# Altium schematic sheet Driver.SchDoc
size 1600 x 1200 mm; SheetNumber: 1; SheetTotal: 1; SPICEModelCacheBTRAQOWF: <root> / <DocumentId>BTRAQOWF</DocumentId> / </root>
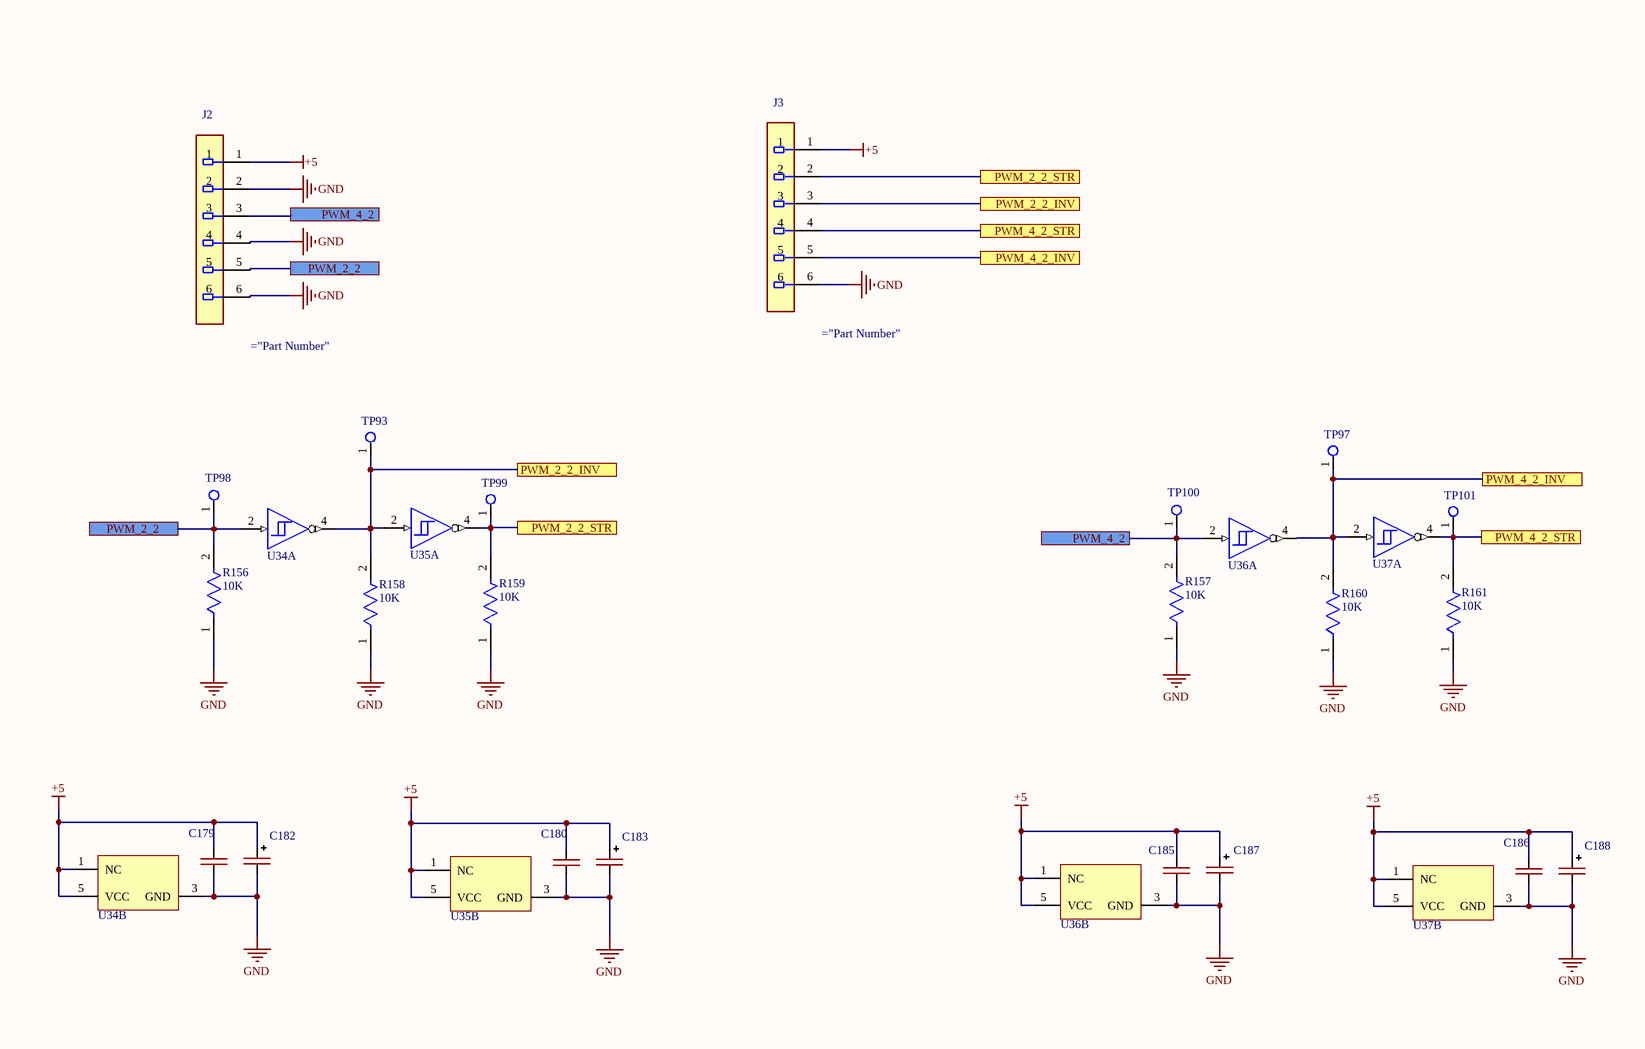
[diagram p0: Driver.SchDoc, left]
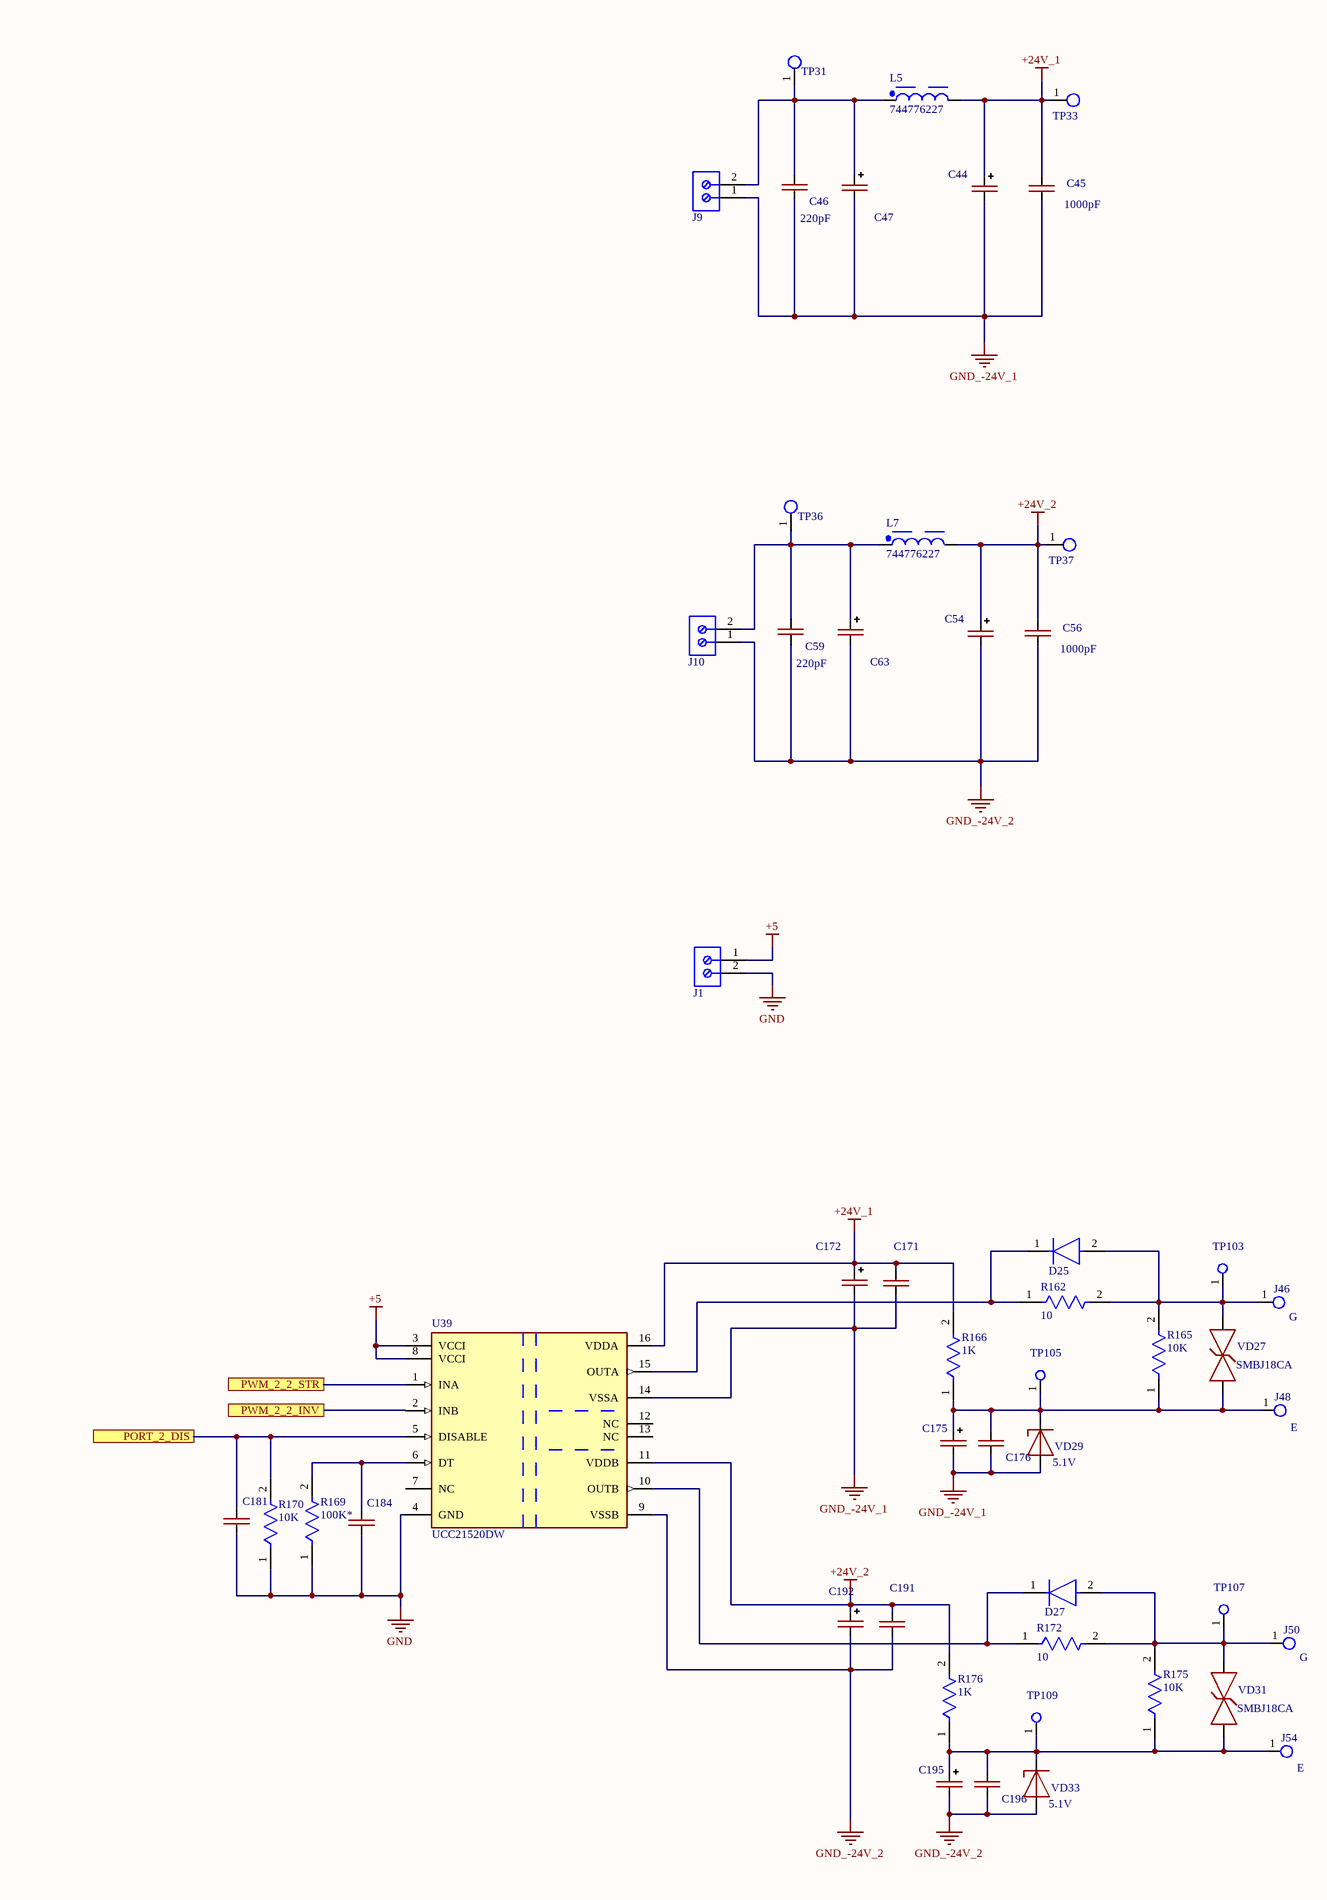
[diagram p1: Driver.SchDoc, middle]
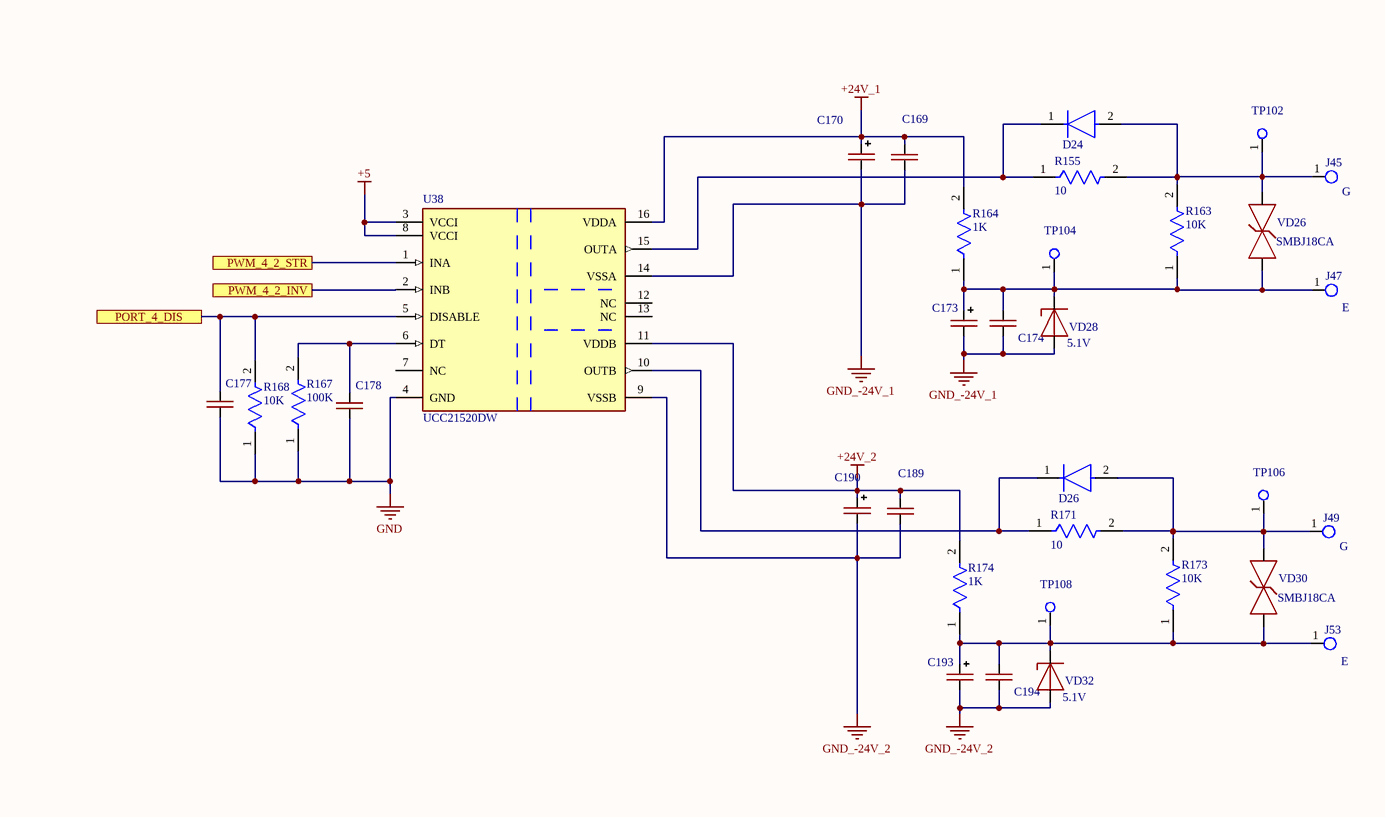
[diagram p2: Driver.SchDoc, right]

## Parts
C44  (no value)  [CAPPOL-12x25]
C45  1000pF  [CAP-1206]
C46  220pF  [CAP-0805]
C47  (no value)  [CAPPOL-12x25]
C54  (no value)  [CAPPOL-12x25]
C56  1000pF  [CAP-1206]
C59  220pF  [CAP-0805]
C63  (no value)  [CAPPOL-12x25]
C169  CAP-NON-POLAR  [CAP-0805]  (value not drawn)
C170  CAP-POLAR  [CAPPOL-16x25]  (value not drawn)
C171  CAP-NON-POLAR  [CAP-0805]  (value not drawn)
C172  CAP-POLAR  [CAPPOL-16x25]  (value not drawn)
C173  CAP-POLAR  [CAP-TAN-D]  (value not drawn)
C174  CAP-NON-POLAR  [CAP-0805]  (value not drawn)
C175  CAP-POLAR  [CAP-TAN-D]  (value not drawn)
C176  CAP-NON-POLAR  [CAP-0805]  (value not drawn)
C177  CAP-NON-POLAR  [CAP-0805]  (value not drawn)
C178  CAP-NON-POLAR  [CAP-0805]  (value not drawn)
C179  CAP-NON-POLAR  [CAP-0805]  (value not drawn)
C180  CAP-NON-POLAR  [CAP-0805]  (value not drawn)
C181  CAP-NON-POLAR  [CAP-0805]  (value not drawn)
C182  CAP-POLAR  [CAP-TAN-D]  (value not drawn)
C183  CAP-POLAR  [CAP-TAN-D]  (value not drawn)
C184  CAP-NON-POLAR  [CAP-0805]  (value not drawn)
C185  CAP-NON-POLAR  [CAP-0805]  (value not drawn)
C186  CAP-NON-POLAR  [CAP-0805]  (value not drawn)
C187  CAP-POLAR  [CAP-TAN-D]  (value not drawn)
C188  CAP-POLAR  [CAP-TAN-D]  (value not drawn)
C189  CAP-NON-POLAR  [CAP-0805]  (value not drawn)
C190  CAP-POLAR  [CAPPOL-16x25]  (value not drawn)
C191  CAP-NON-POLAR  [CAP-0805]  (value not drawn)
C192  CAP-POLAR  [CAPPOL-16x25]  (value not drawn)
C193  CAP-POLAR  [CAP-TAN-D]  (value not drawn)
C194  CAP-NON-POLAR  [CAP-0805]  (value not drawn)
C195  CAP-POLAR  [CAP-TAN-D]  (value not drawn)
C196  CAP-NON-POLAR  [CAP-0805]  (value not drawn)
D24  US1G  [US1G_SMA]  (value not drawn)
D25  US1G  [US1G_SMA]  (value not drawn)
D26  US1G  [US1G_SMA]  (value not drawn)
D27  US1G  [US1G_SMA]  (value not drawn)
J1  691101710002  [691101710002]  (value not drawn)
J2  (no value)  [Sullins_SWR25X-NRTC-S06-ST-BA_MFG]
J3  (no value)  [Sullins_SWR25X-NRTC-S06-ST-BA_MFG]
J9  691101710002  [691101710002]  (value not drawn)
J10  691101710002  [691101710002]  (value not drawn)
J45  G  [Klema_PCB_15A]
J46  G  [Klema_PCB_15A]
J47  E  [Klema_PCB_15A]
J48  E  [Klema_PCB_15A]
J49  G  [Klema_PCB_15A]
J50  G  [Klema_PCB_15A]
J53  E  [Klema_PCB_15A]
J54  E  [Klema_PCB_15A]
L5  744776227  [WE-PD2_1054]
L7  744776227  [WE-PD2_1054]
R155  10  [RES-2512]
R156  10K  [RES-0805]
R157  10K  [RES-0805]
R158  10K  [RES-0805]
R159  10K  [RES-0805]
R160  10K  [RES-0805]
R161  10K  [RES-0805]
R162  10  [RES-2512]
R163  10K  [RES-0805]
R164  1K  [RES-2512]
R165  10K  [RES-0805]
R166  1K  [RES-2512]
R167  100K  [RES-0805]
R168  10K  [RES-0805]
R169  100K*  [RES-0805]
R170  10K  [RES-0805]
R171  10  [RES-2512]
R172  10  [RES-2512]
R173  10K  [RES-0805]
R174  1K  [RES-2512]
R175  10K  [RES-0805]
R176  1K  [RES-2512]
TP31  Test_Point_PCB  [Test_Point]  (value not drawn)
TP33  Test_Point_PCB  [Test_Point]  (value not drawn)
TP36  Test_Point_PCB  [Test_Point]  (value not drawn)
TP37  Test_Point_PCB  [Test_Point]  (value not drawn)
TP93  Test_Point_PCB  [Test_Point]  (value not drawn)
TP97  Test_Point_PCB  [Test_Point]  (value not drawn)
TP98  Test_Point_PCB  [Test_Point]  (value not drawn)
TP99  Test_Point_PCB  [Test_Point]  (value not drawn)
TP100  Test_Point_PCB  [Test_Point]  (value not drawn)
TP101  Test_Point_PCB  [Test_Point]  (value not drawn)
TP102  Test_Point_PCB  [Test_Point]  (value not drawn)
TP103  Test_Point_PCB  [Test_Point]  (value not drawn)
TP104  Test_Point_PCB  [Test_Point]  (value not drawn)
TP105  Test_Point_PCB  [Test_Point]  (value not drawn)
TP106  Test_Point_PCB  [Test_Point]  (value not drawn)
TP107  Test_Point_PCB  [Test_Point]  (value not drawn)
TP108  Test_Point_PCB  [Test_Point]  (value not drawn)
TP109  Test_Point_PCB  [Test_Point]  (value not drawn)
U34  74LVC1G14  [SOT23-5_N]  (value not drawn)  (parts A,B of 2)
U35  74LVC1G14  [SOT23-5_N]  (value not drawn)  (parts A,B of 2)
U36  74LVC1G14  [SOT23-5_N]  (value not drawn)  (parts A,B of 2)
U37  74LVC1G14  [SOT23-5_N]  (value not drawn)  (parts A,B of 2)
U38  UCC21520DW  [FP-DW0016B-MFG]
U39  UCC21520DW  [FP-DW0016B-MFG]
VD26  SMBJ18CA  [DO-214AA]
VD27  SMBJ18CA  [DO-214AA]
VD28  5.1V  [DO-35]
VD29  5.1V  [DO-35]
VD30  SMBJ18CA  [DO-214AA]
VD31  SMBJ18CA  [DO-214AA]
VD32  5.1V  [DO-35]
VD33  5.1V  [DO-35]

## Ports
PORT_2_DIS, PORT_4_DIS, PWM_2_2, PWM_2_2_INV, PWM_2_2_STR, PWM_4_2, PWM_4_2_INV, PWM_4_2_STR

## Nets
+5: C179.2 C180.2 C182.1(+) C183.1(+) C185.2 C186.2 C187.1(+) C188.1(+) J1.1 J2.1 J3.1 U34.1(NC) U34.5(VCC) U35.1(NC) U35.5(VCC) U36.1(NC) U36.5(VCC) U37.1(NC) U37.5(VCC) U38.3(VCCI) U38.8(VCCI) U39.3(VCCI) U39.8(VCCI)
+24V_1: C44.1(+) C45.2 C169.2 C170.1(+) C171.2 C172.1(+) L5.2 R164.2 R166.2 TP33.1(G9) U38.16(VDDA) U39.16(VDDA)
+24V_2: C54.1(+) C56.2 C189.2 C190.1(+) C191.2 C192.1(+) L7.2 R174.2 R176.2 TP37.1(G9) U38.11(VDDB) U39.11(VDDB)
GND: C177.1 C178.1 C179.1 C180.1 C181.1 C182.2(-) C183.2(-) C184.1 C185.1 C186.1 C187.2(-) C188.2(-) J1.2 J2.2 J2.4 J2.6 J3.6 R156.1 R157.1 R158.1 R159.1 R160.1 R161.1 R167.1 R168.1 R169.1 R170.1 U34.3(GND) U35.3(GND) U36.3(GND) U37.3(GND) U38.4(GND) U39.4(GND)
GND_-24V_1: C44.2(-) C45.1 C46.1 C47.2(-) C169.1 C170.2(-) C171.1 C172.2(-) C173.2(-) C174.1 C175.2(-) C176.1 J9.1 U38.14(VSSA) U39.14(VSSA) VD28.2(A) VD29.2(A)
GND_-24V_2: C54.2(-) C56.1 C59.1 C63.2(-) C189.1 C190.2(-) C191.1 C192.2(-) C193.2(-) C194.1 C195.2(-) C196.1 J10.1 U38.9(VSSB) U39.9(VSSB) VD32.2(A) VD33.2(A)
PORT_2_DIS: C181.2 R170.2 U39.5(DISABLE) ; port PORT_2_DIS
PORT_4_DIS: C177.2 R168.2 U38.5(DISABLE) ; port PORT_4_DIS
PWM_2_2: J2.5 R156.2 TP98.1(G9) U34.2(A) ; port PWM_2_2
PWM_2_2_INV: J3.3 R158.2 TP93.1(G9) U34.4(Y) U35.2(A) U39.2(INB) ; port PWM_2_2_INV
PWM_2_2_STR: J3.2 R159.2 TP99.1(G9) U35.4(Y) U39.1(INA) ; port PWM_2_2_STR
PWM_4_2: J2.3 R157.2 TP100.1(G9) U36.2(A) ; port PWM_4_2
PWM_4_2_INV: J3.5 R160.2 TP97.1(G9) U36.4(Y) U37.2(A) U38.2(INB) ; port PWM_4_2_INV
PWM_4_2_STR: J3.4 R161.2 TP101.1(G9) U37.4(Y) U38.1(INA) ; port PWM_4_2_STR
NetC46_2: C46.2 C47.1(+) J9.2 L5.1 TP31.1(G9)
NetC59_2: C59.2 C63.1(+) J10.2 L7.1 TP36.1(G9)
NetC173_1: C173.1(+) C174.2 J47.1 R163.1 R164.1 TP104.1(G9) VD26.1(C) VD28.1(C)
NetC175_1: C175.1(+) C176.2 J48.1 R165.1 R166.1 TP105.1(G9) VD27.1(C) VD29.1(C)
NetC178_2: C178.2 R167.2 U38.6(DT)
NetC184_2: C184.2 R169.2 U39.6(DT)
NetC193_1: C193.1(+) C194.2 J53.1 R173.1 R174.1 TP108.1(G9) VD30.1(C) VD32.1(C)
NetC195_1: C195.1(+) C196.2 J54.1 R175.1 R176.1 TP109.1(G9) VD31.1(C) VD33.1(C)
NetD24_1: D24.1(C) R155.1 U38.15(OUTA)
NetD24_2: D24.2(A) J45.1 R155.2 R163.2 TP102.1(G9) VD26.2(A)
NetD25_1: D25.1(C) R162.1 U39.15(OUTA)
NetD25_2: D25.2(A) J46.1 R162.2 R165.2 TP103.1(G9) VD27.2(A)
NetD26_1: D26.1(C) R171.1 U38.10(OUTB)
NetD26_2: D26.2(A) J49.1 R171.2 R173.2 TP106.1(G9) VD30.2(A)
NetD27_1: D27.1(C) R172.1 U39.10(OUTB)
NetD27_2: D27.2(A) J50.1 R172.2 R175.2 TP107.1(G9) VD31.2(A)

Not connected (* = marked no-connect by the designer): U38 7(NC) 12(NC) 13(NC); U39 7(NC) 12(NC) 13(NC)

## Library data of the parts
C44 C47 C54 C63 = CAP-POLAR
C45 C46 C56 C59 = CAP-NON-POLAR
J1 J9 J10 = 691101710002: WR-TBL Series 101 Horizontal Entry Modular, THT, pitch 5mm, 2p; Manufacturer: Wurth Elektronik; Modularity: Yes; Rated Current: 16A; Working Voltage: 250V; ComponentLink1Description: Website Link; ComponentLink1URL: https://www.we-online.com/redexpert/article/691101710002?ad; ComponentLink2Description: Datasheet Link; ComponentLink2URL: https://www.we-online.com/redexpert/spec/691101710002?ad; Manufacturer Part Number: 691101710002; Category: Terminal Blocks; Match Code: WR-TBL; Mount: Through Hole; Operating Temperature Max: 105°C; Operating Temperature Min: -40°C; Packaging: Box; Application: Pressure Clamp; Number of Pins: 2; Number of Rows: 1; Orientation: Horizontal; Pitch: 5mm
J2 J3 = SWR25X-NRTC-S06-ST-BA
J45-J50 J53 J54 = Klema_15_A
L5 L7 = CMP-0227-00501-2: NexarPartId: 24533346; Inductance: 270µH; Current Rating: 620mA; Self Resonant Frequency: 4MHz; DC Resistance (DCR): 500mΩ; Ambient Temperature Range Low: -40°C; Min Operating Temperature: -40°C; RoHS: Compliant; Ambient Temperature Range High: 85°C; Packaging: Digi-Reel®; Height: 5.4mm; Length: 9mm; Max Operating Temperature: 125°C; Width: 10mm
R155-R168 R170-R176 = RES-CONST
R169 = RES-CONST: 100K
TP31 TP33 TP36 TP37 TP93 TP97-TP109 = TP_PCB?: Test_Point
VD26 VD27 VD30 VD31 = Suppressor
VD28 VD29 VD32 VD33 = ZENER